# EAGLE schematic shield9 (EAGLE 8.7.1)
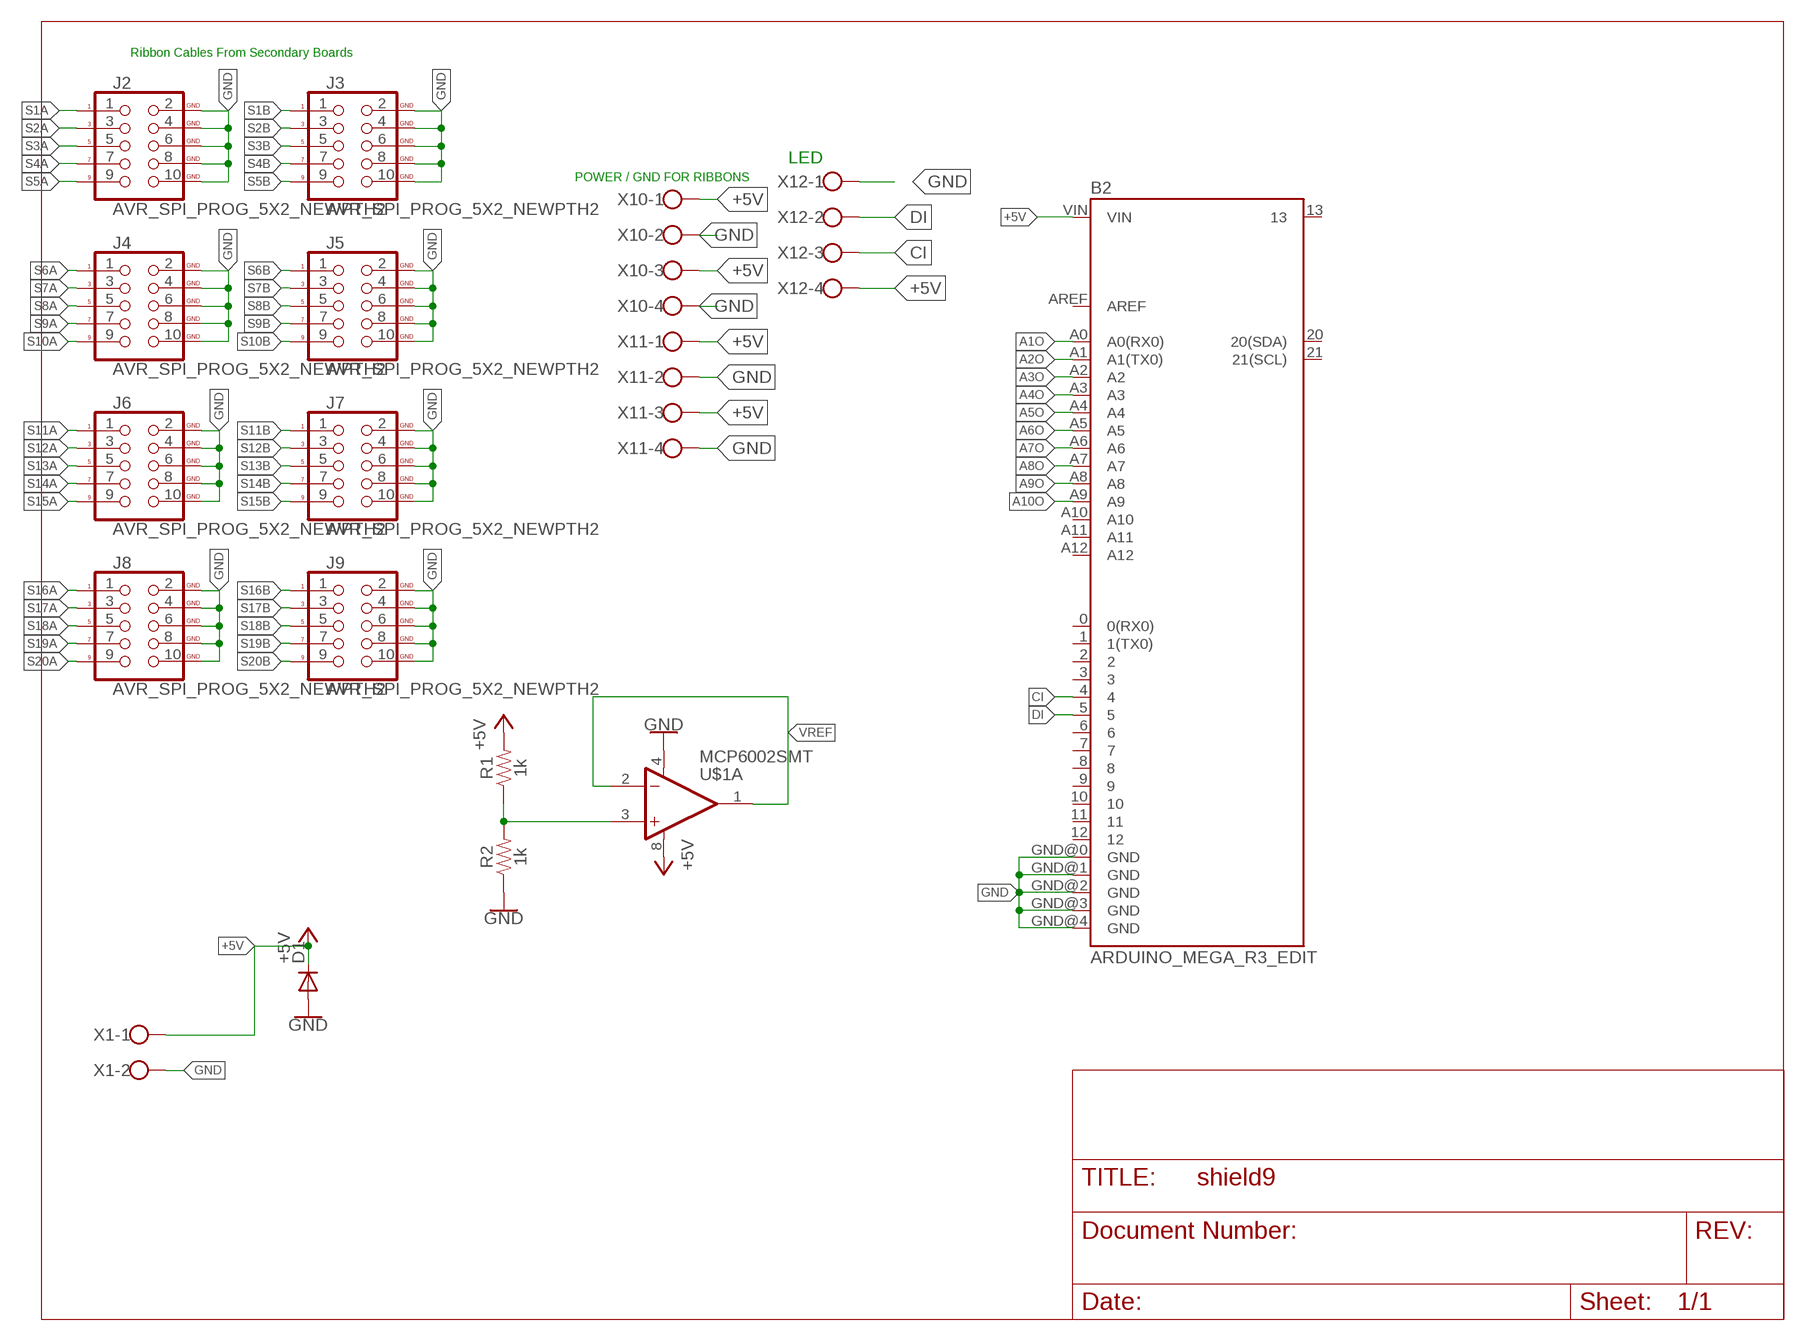
[diagram p0: schematic, sheet 1, part 1 of 2]
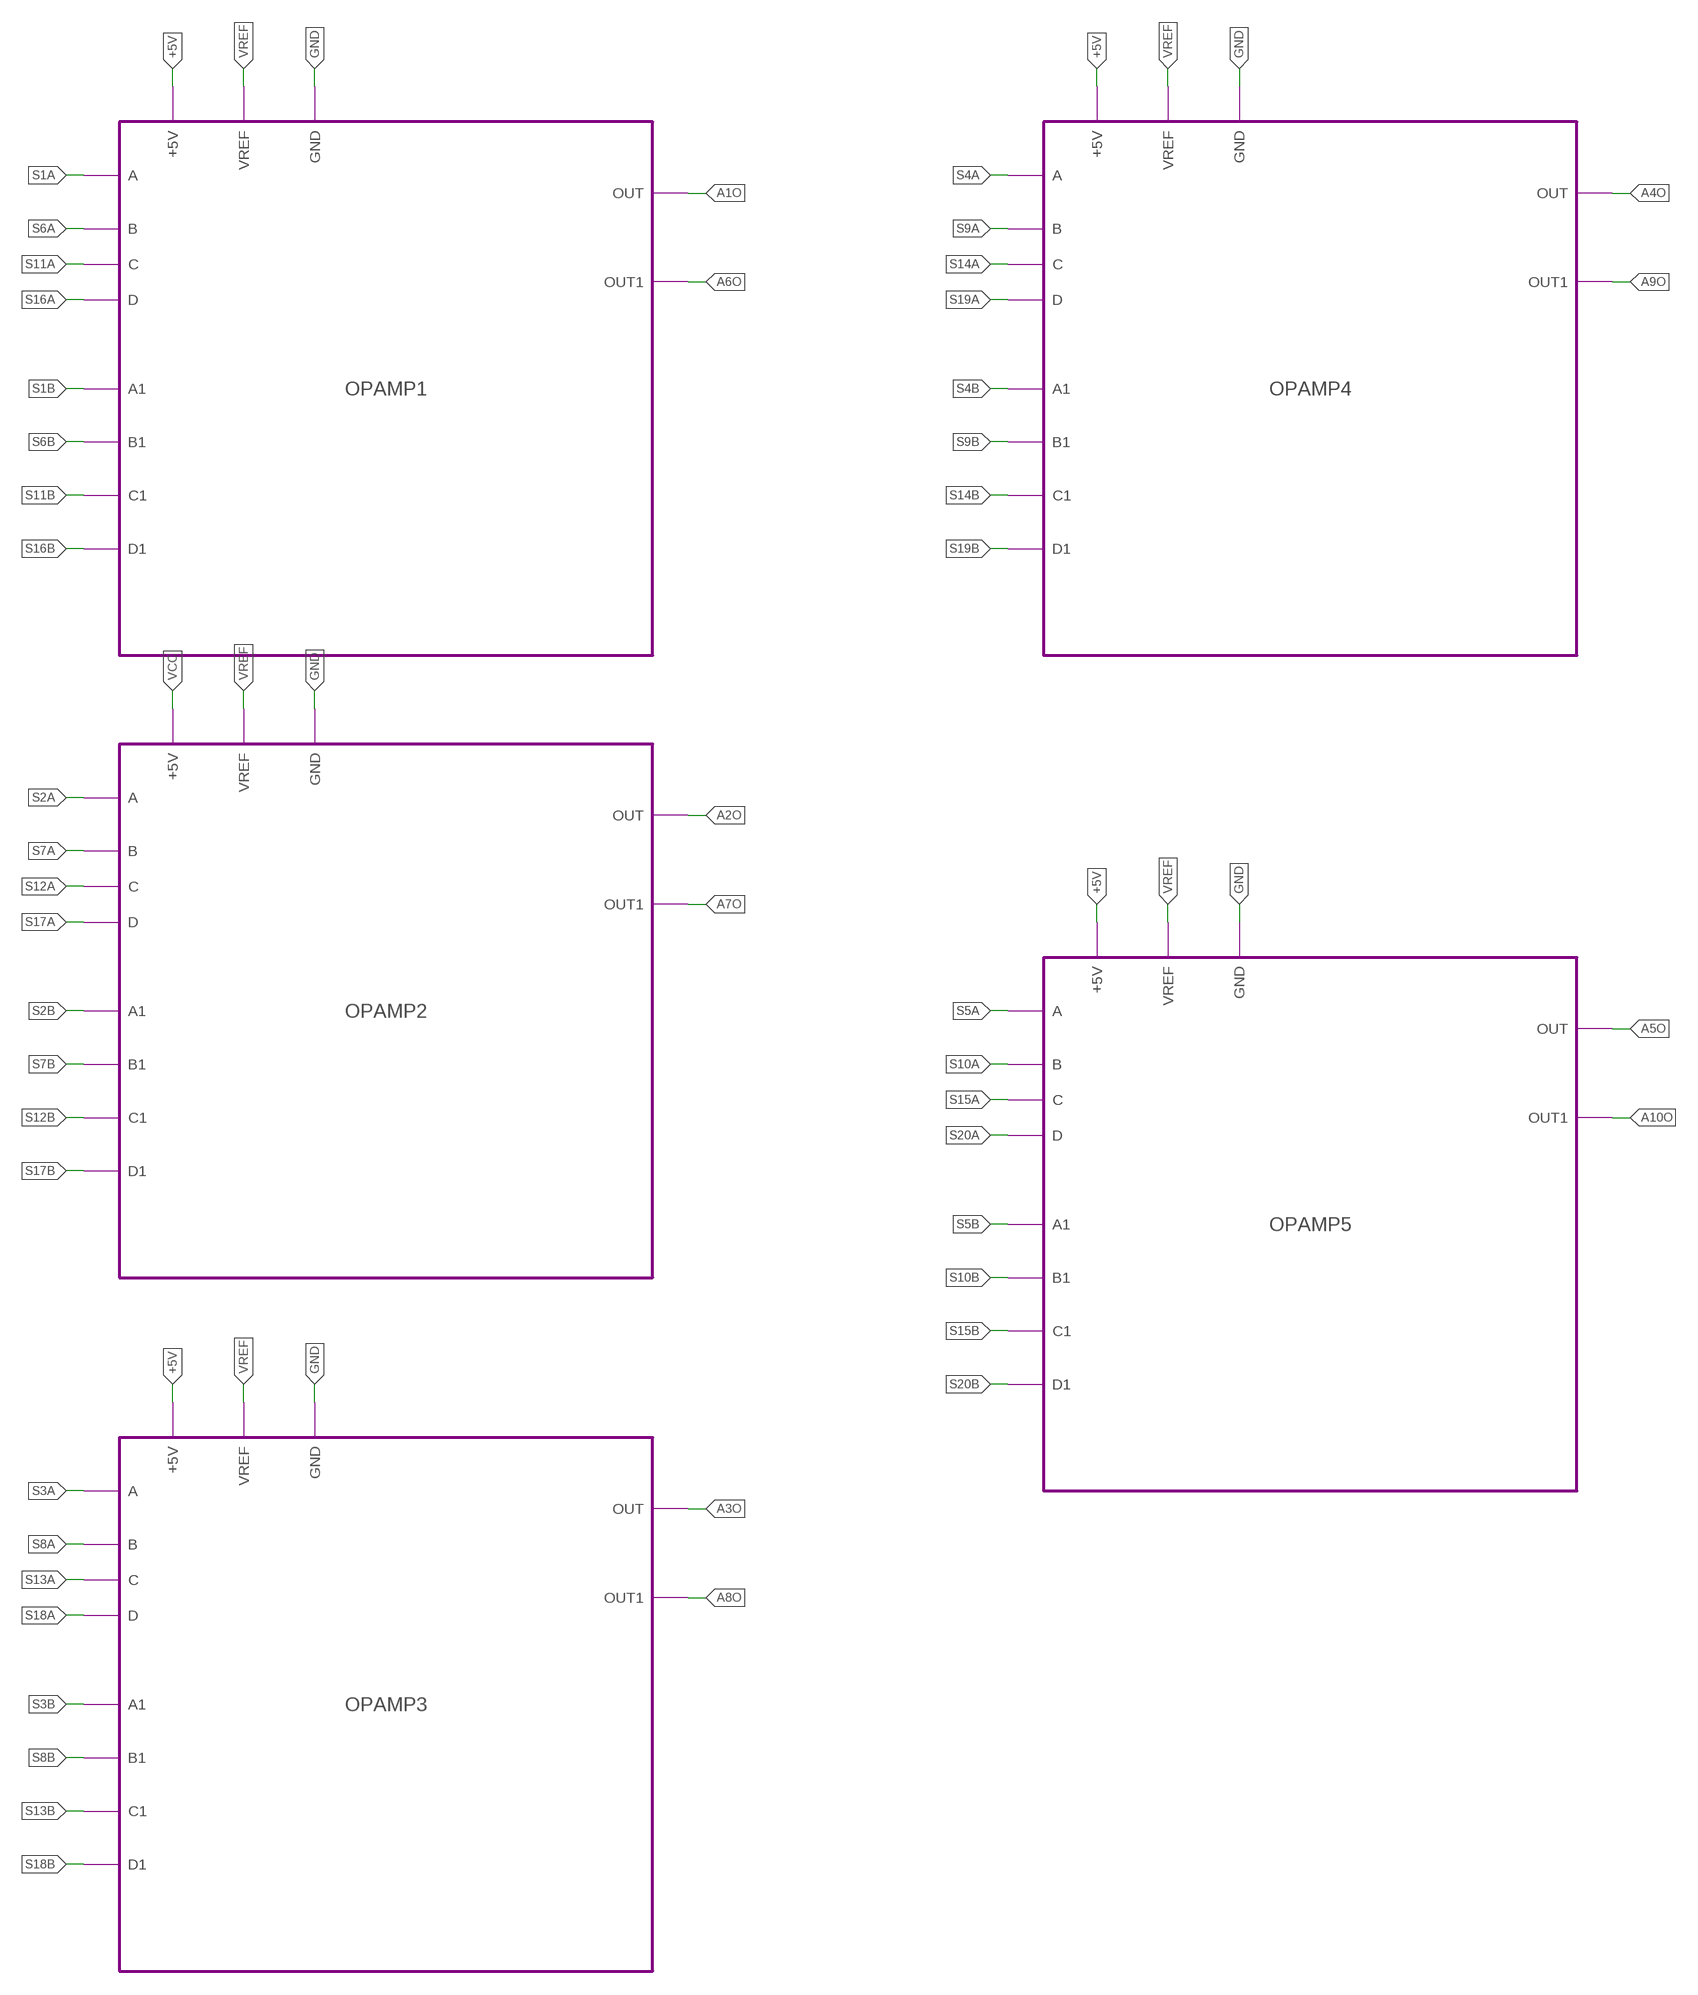
[diagram p1: schematic, sheet 1, part 2 of 2]

## Parts
B2  ARDUINO_MEGA_R3_EDIT  [ARDUINO_MEGA_EDIT]
D1  DIODE-DO-214AC  [DO-214AC]
J2  AVR_SPI_PROG_5X2_NEWPTH2  [2X5-SHROUDED]
J3  AVR_SPI_PROG_5X2_NEWPTH2  [2X5-SHROUDED]
J4  AVR_SPI_PROG_5X2_NEWPTH2  [2X5-SHROUDED]
J5  AVR_SPI_PROG_5X2_NEWPTH2  [2X5-SHROUDED]
J6  AVR_SPI_PROG_5X2_NEWPTH2  [2X5-SHROUDED]
J7  AVR_SPI_PROG_5X2_NEWPTH2  [2X5-SHROUDED]
J8  AVR_SPI_PROG_5X2_NEWPTH2  [2X5-SHROUDED]
J9  AVR_SPI_PROG_5X2_NEWPTH2  [2X5-SHROUDED]
R1  1k  RESISTOR0805  [0805]
R2  1k  RESISTOR0805  [0805]
U$1  MCP6002SMT  [SOIC8]
X1  W237-102  [W237-102]
X10  W237-4  [W237-4]
X11  W237-4  [W237-4]
X12  W237-4  [W237-4]

## Module instances
OPAMP1 = OPAMP
OPAMP2 = OPAMP
OPAMP3 = OPAMP
OPAMP4 = OPAMP
OPAMP5 = OPAMP

## Nets
+5V: B2.VIN D1.C R1.2 U$1.8(A:V+) X1.1 X10.1 X10.3 X11.1 X11.3 X12.4 ; port OPAMP3.+5V OPAMP4.+5V OPAMP5.+5V OPAMP1.+5V
A1O: B2.A0(A0(RX0)) ; port OPAMP1.OUT
A2O: B2.A1(A1(TX0)) ; port OPAMP2.OUT
A3O: B2.A2 ; port OPAMP3.OUT
A4O: B2.A3 ; port OPAMP4.OUT
A5O: B2.A4 ; port OPAMP5.OUT
A6O: B2.A5 ; port OPAMP1.OUT1
A7O: B2.A6 ; port OPAMP2.OUT1
A8O: B2.A7 ; port OPAMP3.OUT1
A9O: B2.A8 ; port OPAMP4.OUT1
A10O: B2.A9 ; port OPAMP5.OUT1
CI: B2.4 X12.3
DI: B2.5 X12.2
GND: B2.GND@0(GND) B2.GND@1(GND) B2.GND@2(GND) B2.GND@3(GND) B2.GND@4(GND) D1.A J2.2(GND) J2.4(GND) J2.6(GND) J2.8(GND) J2.10(GND) J3.2(GND) J3.4(GND) J3.6(GND) J3.8(GND) J3.10(GND) J4.2(GND) J4.4(GND) J4.6(GND) J4.8(GND) J4.10(GND) J5.2(GND) J5.4(GND) J5.6(GND) J5.8(GND) J5.10(GND) J6.2(GND) J6.4(GND) J6.6(GND) J6.8(GND) J6.10(GND) J7.2(GND) J7.4(GND) J7.6(GND) J7.8(GND) J7.10(GND) J8.2(GND) J8.4(GND) J8.6(GND) J8.8(GND) J8.10(GND) J9.2(GND) J9.4(GND) J9.6(GND) J9.8(GND) J9.10(GND) R2.1 U$1.4(A:V-) X1.2 X10.2 X10.4 X11.2 X11.4 X12.1 ; port OPAMP2.GND OPAMP3.GND OPAMP4.GND OPAMP5.GND OPAMP1.GND
N$2: R1.1 R2.2 U$1.3(A:+IN)
S1A: J2.1 ; port OPAMP1.A
S1B: J3.1 ; port OPAMP1.A1
S2A: J2.3 ; port OPAMP2.A
S2B: J3.3 ; port OPAMP2.A1
S3A: J2.5 ; port OPAMP3.A
S3B: J3.5 ; port OPAMP3.A1
S4A: J2.7 ; port OPAMP4.A
S4B: J3.7 ; port OPAMP4.A1
S5A: J2.9 ; port OPAMP5.A
S5B: J3.9 ; port OPAMP5.A1
S6A: J4.1 ; port OPAMP1.B
S6B: J5.1 ; port OPAMP1.B1
S7A: J4.3 ; port OPAMP2.B
S7B: J5.3 ; port OPAMP2.B1
S8A: J4.5 ; port OPAMP3.B
S8B: J5.5 ; port OPAMP3.B1
S9A: J4.7 ; port OPAMP4.B
S9B: J5.7 ; port OPAMP4.B1
S10A: J4.9 ; port OPAMP5.B
S10B: J5.9 ; port OPAMP5.B1
S11A: J6.1 ; port OPAMP1.C
S11B: J7.1 ; port OPAMP1.C1
S12A: J6.3 ; port OPAMP2.C
S12B: J7.3 ; port OPAMP2.C1
S13A: J6.5 ; port OPAMP3.C
S13B: J7.5 ; port OPAMP3.C1
S14A: J6.7 ; port OPAMP4.C
S14B: J7.7 ; port OPAMP4.C1
S15A: J6.9 ; port OPAMP5.C
S15B: J7.9 ; port OPAMP5.C1
S16A: J8.1 ; port OPAMP1.D
S16B: J9.1 ; port OPAMP1.D1
S17A: J8.3 ; port OPAMP2.D
S17B: J9.3 ; port OPAMP2.D1
S18A: J8.5 ; port OPAMP3.D
S18B: J9.5 ; port OPAMP3.D1
S19A: J8.7 ; port OPAMP4.D
S19B: J9.7 ; port OPAMP4.D1
S20A: J8.9 ; port OPAMP5.D
S20B: J9.9 ; port OPAMP5.D1
VCC: port OPAMP2.+5V
VREF: U$1.1(A:OUT) U$1.2(A:-IN) ; port OPAMP2.VREF OPAMP3.VREF OPAMP4.VREF OPAMP5.VREF OPAMP1.VREF
Unconnected: B2.0(0(RX0)) B2.1(1(TX0)) B2.2 B2.3 B2.6 B2.7 B2.8 B2.9 B2.10 B2.11 B2.12 B2.13 B2.20(20(SDA)) B2.21(21(SCL)) B2.A10 B2.A11 B2.A12 B2.AREF U$1.5(B:+IN) U$1.6(B:-IN) U$1.7(B:OUT)

## Notes on the sheet
- Ribbon Cables From Secondary Boards
- LED
- POWER / GND FOR RIBBONS

## Library data of the parts
B2 = SparkFun-Boards:ARDUINO_MEGA_R3_EDIT: Arduino Mega R3 ATmega2560 R3 compatible footprint. SparkFun Products: Arduino Mega 2560 R3 <https://www.sparkfun.com/products/11061>
D1 = diode:DIODE-: DIODE
J2-J9 = SparkFun-Connectors:AVR_SPI_PROG_5X2_NEW: AVR 10-pin ICSP Header This is the standard AVR In Circuit Serial Programming header. Minimal, but includes pin one indicator. Works with standard Olimex programmers. SparkFun Products: 2x5 AVR ICSP Male Header <https://www.sparkfun.com/products/778> - PTH 2x5 Pin Shrouded Header <https://www.sparkfun.com/products/8506> - PTH2; PROD_ID: CONN-08671; SF_ID: PRT-08506
R1 R2 = SparkFun-Resistors:RESISTOR: Generic Resistor Package
U$1 = adam - ics:MCP6002: Dual General Op Amp 1.8V min supply 1MHz (6V/us)
X1 = con-wago-500:W237-102: WAGO SCREW CLAMP; MPN: 237-102; OC_FARNELL: unknown; OC_NEWARK: 70K9898
X10-X12 = con-wago-500:W237-4: WAGO SCREW CLAMP; OC_FARNELL: unknown; OC_NEWARK: unknown

## Module OPAMP
Ports: A(in) B(in) C(in) D(in) A1(in) B1(in) C1(in) D1(in) +5V(pwr) VREF(pwr) GND(pwr) OUT(out) OUT1(out)
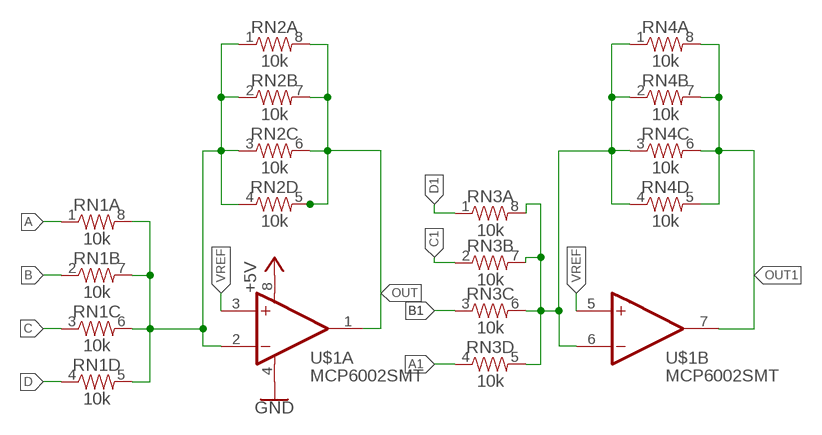
[diagram p2: schematic, module OPAMP, sheet 1]

### Parts
RN1  10k  1KOHM-ARRAY(4)0805-ARV-EDIT10K  [0805-ARV_EDIT10K]
RN2  10k  1KOHM-ARRAY(4)0805-ARV-EDIT10K  [0805-ARV_EDIT10K]
RN3  10k  1KOHM-ARRAY(4)0805-ARV-EDIT10K  [0805-ARV_EDIT10K]
RN4  10k  1KOHM-ARRAY(4)0805-ARV-EDIT10K  [0805-ARV_EDIT10K]
U$1  MCP6002SMT  [SOIC8]

### Nets
+5V: U$1.8(A:V+)
A: RN1.1
A1: RN3.4
B: RN1.2
B1: RN3.3
C: RN1.3
C1: RN3.2
D: RN1.4
D1: RN3.1
GND: U$1.4(A:V-)
N$1: RN3.5 RN3.6 RN3.7 RN3.8 RN4.1 RN4.2 RN4.3 RN4.4 U$1.6(B:-IN)
N$2: RN1.5 RN1.6 RN1.7 RN1.8 RN2.1 RN2.2 RN2.3 RN2.4 U$1.2(A:-IN)
OUT: RN2.5 RN2.6 RN2.7 RN2.8 U$1.1(A:OUT)
OUT1: RN4.5 RN4.6 RN4.7 RN4.8 U$1.7(B:OUT)
VREF: U$1.3(A:+IN) U$1.5(B:+IN)

### Library data of the parts
RN1-RN4 = SparkFun-Resistors:1KOHM-ARRAY(4): 4 x 1kΩ resistor array A resistor is a passive two-terminal electrical component that implements electrical resistance as a circuit element. Resistors act to reduce current flow, and, at the same time, act to lower voltage levels within circuits. - Wikipedia An array is a collection of discrete resistors in a single package.
U$1 = adam - ics:MCP6002: Dual General Op Amp 1.8V min supply 1MHz (6V/us)

## Net classes
0 default: width 0.203 mm, drill 0.381 mm, clearance 0.203 mm